# Altium schematic sheet VC_02_AI.SchDoc
size A4; SheetNumber: 7; SheetTotal: 11
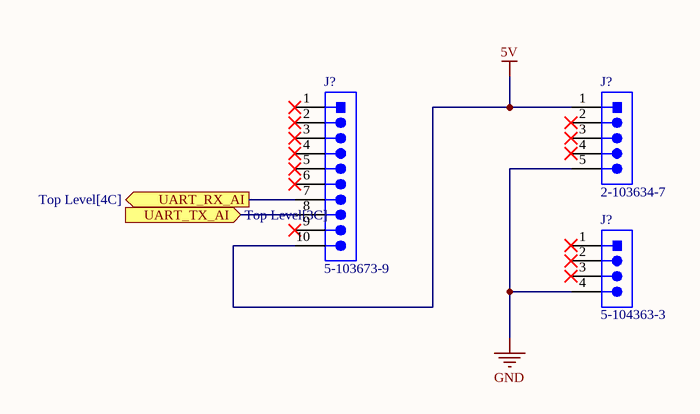
[diagram p0: VC_02_AI.SchDoc]

## Parts
(Parts that share a designator on the sheet are numbered #1, #2 ... from top to bottom, then left to right.)
J?#1  2-103634-7
J?#2  5-103673-9  [5-103673-9-Footprint-1]
J?#3  5-104363-3  [5-104363-3-Footprint-1]

## Ports
UART_RX_AI (out, see Top Level[4C]), UART_TX_AI (in, see Top Level[3C])

## Nets
5V: J?#1.1 J?#2.10
GND: J?#1.5 J?#3.4
UART_RX_AI: J?#2.7 ; port UART_RX_AI
UART_TX_AI: J?#2.8 ; port UART_TX_AI

Not connected (* = marked no-connect by the designer): J?#1 2* 3* 4*; J?#2 1* 2* 3* 4* 5* 6* 9*; J?#3 1* 2* 3*

## Library data of the parts
J?#1 = CMP-000961-1: Board Connector, 5 Contact(s), 1 Row(s), Male, Right Angle, Solder Terminal, Black Insulator; Manufacturer Series: 103634; Filter Feature: No; Option: General Purpose; Rated Current (Signal): 3A; Body Length: 0.6inch; Number Of PCB Rows: 1; Mating Connector P/N: 104257-4; PCB Contact Pattern: RECTANGULAR; Reliability: COMMERCIAL; Durability: 75Cycles; Insertion Force-Max: 2.502N; Contact Resistance: 15mR; Body/Shell Style: PLUG; Polarization Key: POLARIZED HOUSING; Body Breadth: 0.275inch; Contact Style: SQ PIN-SKT; Mounting Option 1: LOCKING; Reference Standard: UL; Withdrawl Force-Min: 0.278N; Mating Contact Pitch: 0.1inch; Dielectric Withstanding Voltage (AC): 600V; Insulation Resistance: 400MR; Plating Thickness: 15uin; Mating Information: MULTIPLE MATING PARTS AVAILABLE; Number of Contacts: 5; Body Depth: 0.535inch; Terminal Pitch: 2.54mm; Min Operating Temperature: -65°C; Reach SVHC Compliant: Yes; Max Operating Temperature: 105°C; Contact Finish - Termination: TIN; Termination: Solder; JESD-609 Code: e3; Contact Gender: Male; Connector Type: BOARD CONNECTOR; Number Of Connectors: 1; Mixed Contacts: No; IEC Conformance: No; Mounting Technology: Board; Insulation Material: Glass; DIN Conformance: No; Contact Material: Brass; Flammability Rating: UL94 V-0; Contact Pattern: RECTANGULAR; Number of Rows Loaded: 1; Mounting Style: RIGHT ANGLE; RoHS Compliant: Yes; Terminal Length: 0.13inch; Insulation Color: Black; MIL Conformance: No
J?#2 = CMP-00510-1: Board Connector, 10 Contact(s), 1 Row(s), Male, Right Angle, 0.1 inch Pitch, Solder Terminal, Latch, Black Insulator, Plug; Rated Current (Signal): 3A; Contact Pattern: RECTANGULAR; Number Of PCB Rows: 1; Insulation Resistance: 400MR; Additional Feature: POLARIZED; Body Breadth: 0.275inch; Option: General Purpose; Mixed Contacts: No; Dielectric Withstanding Voltage (AC): 600V; Durability: 75Cycles; Body Depth: 0.535inch; Board Mounting Option: HOLE .125-.137; Insertion Force-Max: 2.502N; Reference Standard: UL; Contact Resistance: 15mR; Number of Contacts: 10; Withdrawl Force-Min: 0.278N; Plating Thickness: 15uin; Polarization Key: POLARIZED HOUSING; Mating Information: MULTIPLE MATING PARTS AVAILABLE; Body Length: 1.1inch; Contact Style: SQ PIN-SKT; Reliability: COMMERCIAL; Flammability Rating: UL94 V-0; Min Operating Temperature: -65°C; Insulation Color: Black; RoHS Compliant: Yes; Mounting Style: RIGHT ANGLE; Connector Type: BOARD CONNECTOR; Contact Finish - Termination: TIN; Mounting Technology: Board; Max Operating Temperature: 105°C; Termination: Solder; DIN Conformance: No; Contact Material: Brass; Insulation Material: Glass; MIL Conformance: No; IEC Conformance: No; Number Of Connectors: 1; Contact Finish - Mating: NOT SPECIFIED; PCB Contact Pattern: RECTANGULAR; Mating Contact Pitch: 0.1inch; Contact Gender: Male; Filter Feature: No; Reach SVHC Compliant: Yes; JESD-609 Code: e3; Mounting Option 1: LATCH; Body/Shell Style: PLUG; Number of Rows Loaded: 1; Terminal Pitch: 2.54mm
J?#3 = CMP-00105-2: Board Connector, 4 Contact(s), 1 Row(s), Male, Straight, 0.1 inch Pitch, Solder Terminal, Locking, Black Insulator, Plug